# EAGLE design rbgLED-breakout (EAGLE 5.06)
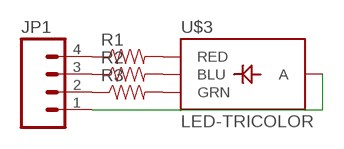
[diagram p0: schematic, sheet 1]

## Parts
JP1  M04LOCK_LONGPADS  [1X04_LOCK_LONGPADS]
R1  RESISTOR0603-RES  [0603-RES]
R2  RESISTOR0603-RES  [0603-RES]
R3  RESISTOR0603-RES  [0603-RES]
U$3  LED-TRICOLOR  [LED-TRICOLOR-SMD]

## Nets
N$1: R1.2 U$3.R(RED)
N$2: R2.2 U$3.B(BLU)
N$3: R3.2 U$3.G(GRN)
N$4: JP1.4 R1.1
N$5: JP1.3 R2.1
N$6: JP1.2 R3.1
N$7: JP1.1 U$3.A

## Library data of the parts
JP1 = SparkFun:M04: Header 4 Standard 4-pin 0.1" header. Use with straight break away headers (SKU : PRT-00116), right angle break away headers (PRT-00553), swiss pins (PRT-00743), machine pins (PRT-00117), and female headers (PRT-00115). Molex polarized connector foot print use with SKU : PRT-08231 with associated crimp pins and housings.
R1-R3 = SparkFun:RESISTOR: Resistor Basic schematic elements and footprints for 0603, 1206, and PTH 1/10th watt (small) resistors.
U$3 = SparkFun:LED-TRICOLOR: Tri-Color LED SMD Proven layout and schematic for triple color LED in SMD package - common anode. Spark Fun Electronics SKU : COM-07844

## Board
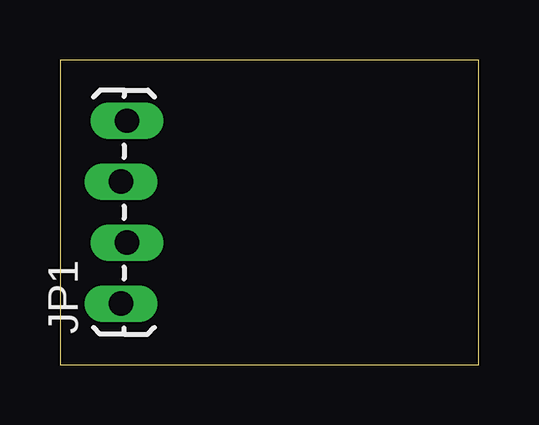
[diagram p1: board, top side]
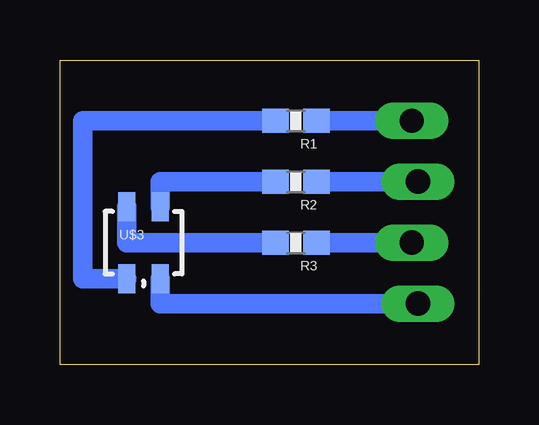
[diagram p2: board, bottom side, seen from below]

Size 17.45 x 12.69 mm. Coordinates in mm from the lower left corner, seen from the top.
Outline: 0,0 17.45,0 17.45,12.69 0,12.69 0,0
Copper layers (1*16): Top 0.035mm / dielectric 1.5mm / Bottom 0.035mm
Design rules "default": minimum track width 10mil, minimum drill 24mil, track to track 8mil, track to pad 8mil, pad to pad 8mil, via to via 8mil, smd to smd 8mil, copper to edge 40mil, drill to drill 8mil, minimum pad ring 10mil, minimum via ring 8mil, stop-mask expansion 4mil, vias tented up to drill 0mil, thermal gap 10mil

### Footprints (pad centres in the part's own frame; a part is rotated, then mirrored left to right if it is on the bottom)
1X04_LOCK_LONGPADS = drill 1.016 long: 1 0,0; 2 2.54,-0.254; 3 5.08,0; 4 7.62,-0.254
0603-RES = smd 1.1 x 1: 1 -0.85,0; 2 0.85,0
LED-TRICOLOR-SMD = smd 0.7 x 1.2: A 0.7,-1.5; B 0.7,1.5; G -0.7,1.5; R -0.7,-1.5

### Placement (x,y rotation side)
JP1  2.54,2.54 90 top
R1  7.62,10.16 180 bottom
R2  7.62,7.62 180 bottom
R3  7.62,5.08 180 bottom
U$3  13.97,5.08 0 bottom

### Tracks (layer width: path | path; a pad name or v marks a point on that pad's centre or on a via)
N$1
  Bottom 0.813: U$3.R 16.51,3.58 16.51,10.16 R1.2
N$2
  Bottom 0.813: U$3.B 13.27,7.62 R2.2
N$3
  Bottom 0.813: R3.2 14.67,5.08 U$3.G
N$4
  Bottom 0.813: JP1.4 R1.1
N$5
  Bottom 0.813: JP1.3 R2.1
N$6
  Bottom 0.813: JP1.2 R3.1
N$7
  Bottom 0.813: JP1.1 13.27,2.54 U$3.A